# Altium schematic sheet STSPIN32F0A ESC2.SchDoc
size A3
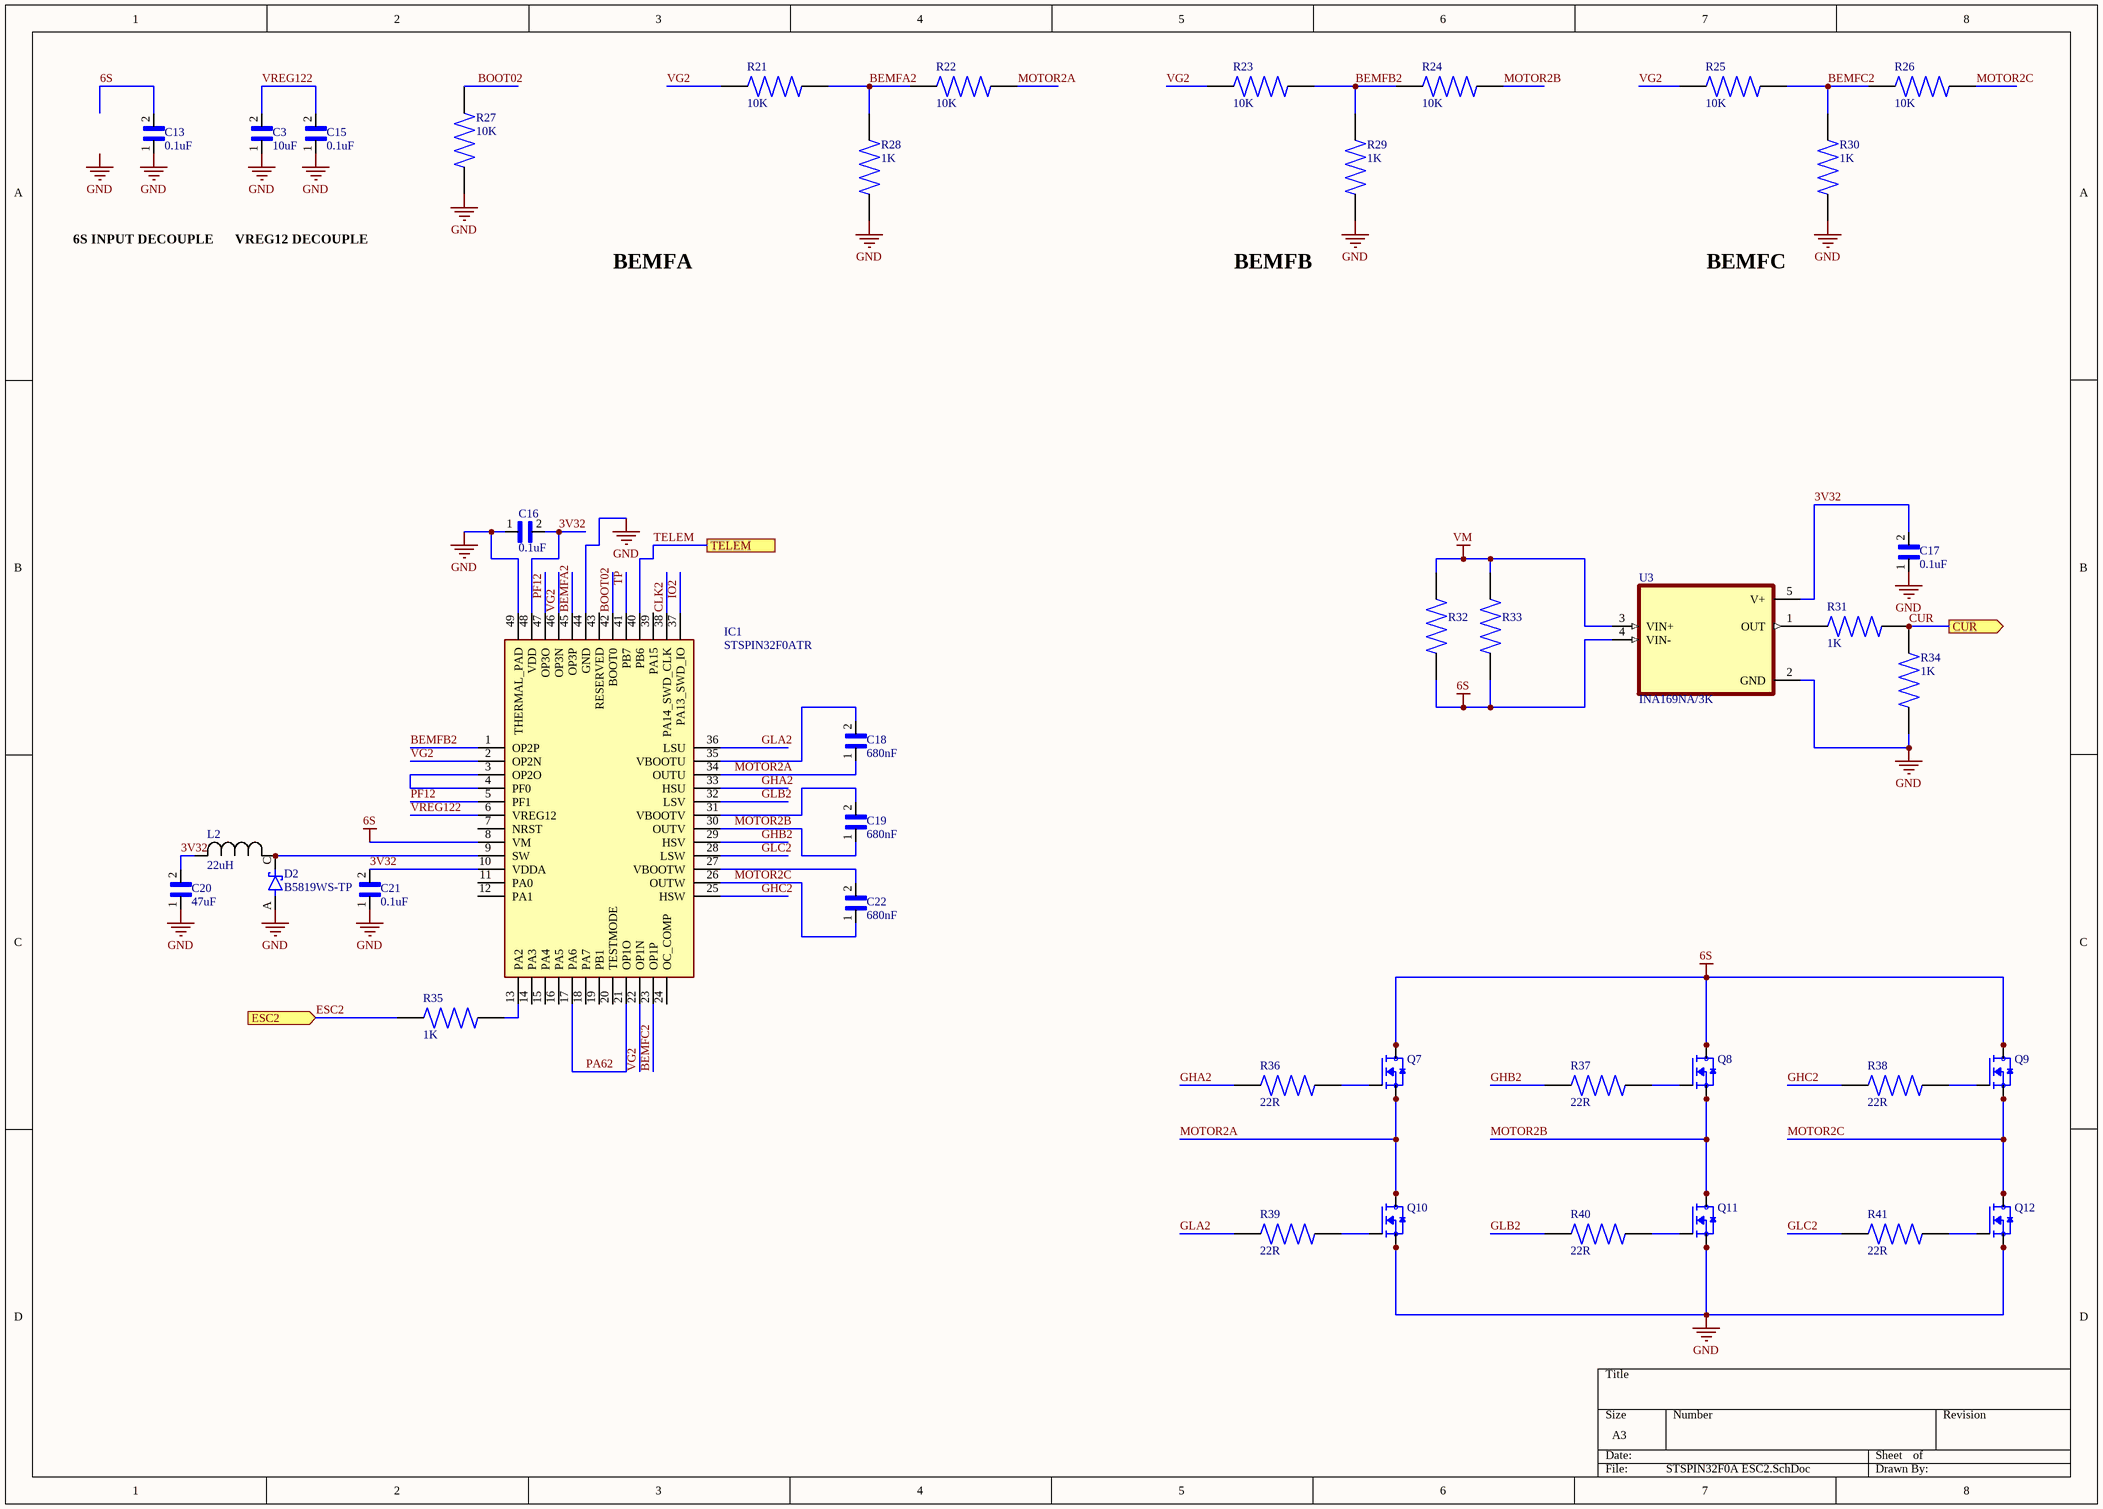
[diagram p0: STSPIN32F0A ESC2.SchDoc]

## Parts
C3  10uF  [CAPC1608X90N]
C13  0.1uF  [CAPC1005X55N]
C15  0.1uF  [CAPC1005X55N]
C16  0.1uF  [CAPC1005X55N]
C17  0.1uF  [CAPC1005X55N]
C18  680nF  [CAPC1005X55N]
C19  680nF  [CAPC1005X55N]
C20  47uF  [CAPC1608X90N]
C21  0.1uF  [CAPC1005X55N]
C22  680nF  [CAPC1005X55N]
D2  B5819WS-TP  [SOD2512X115N]
IC1  STSPIN32F0ATR  [QFN50P700X700X100-49N-D]
L2  22uH  [IND_BOURNS_SRN3015]
Q7  TPHR8504PL,L1Q  [TRANS_TPHR8504PL,L1Q]  (value not drawn)
Q8  TPHR8504PL,L1Q  [TRANS_TPHR8504PL,L1Q]  (value not drawn)
Q9  TPHR8504PL,L1Q  [TRANS_TPHR8504PL,L1Q]  (value not drawn)
Q10  TPHR8504PL,L1Q  [TRANS_TPHR8504PL,L1Q]  (value not drawn)
Q11  TPHR8504PL,L1Q  [TRANS_TPHR8504PL,L1Q]  (value not drawn)
Q12  TPHR8504PL,L1Q  [TRANS_TPHR8504PL,L1Q]  (value not drawn)
R21  10K  [RESC1005X37N]
R22  10K  [RESC1005X37N]
R23  10K  [RESC1005X37N]
R24  10K  [RESC1005X37N]
R25  10K  [RESC1005X37N]
R26  10K  [RESC1005X37N]
R27  10K  [RESC1005X37N]
R28  1K  [RESC1005X37N]
R29  1K  [RESC1005X37N]
R30  1K  [RESC1005X37N]
R31  1K  [RESC1005X37N]
R32  CSSH2512JTL500  [RESC6232X104N]  (value not drawn)
R33  CSSH2512JTL500  [RESC6232X104N]  (value not drawn)
R34  1K  [RESC1005X37N]
R35  1K  [RESC1005X37N]
R36  22R  [RESC1005X37N]
R37  22R  [RESC1005X37N]
R38  22R  [RESC1005X37N]
R39  22R  [RESC1005X37N]
R40  22R  [RESC1005X37N]
R41  22R  [RESC1005X37N]
U3  INA169NA/3K  [SOT95P280X145-5N]

## Ports
CUR (out), ESC2 (in), TELEM

## Nets
6S: C13.2 IC1.8(VM) Q7.5(D) Q7.6(D) Q7.7(D) Q7.8(D) Q7.9(D) Q8.5(D) Q8.6(D) Q8.7(D) Q8.8(D) Q8.9(D) Q9.5(D) Q9.6(D) Q9.7(D) Q9.8(D) Q9.9(D) R32.2 R33.2 U3.4(VIN-)
GND: C3.1 C13.1 C15.1 C16.1 C17.1 C20.1 C21.1 D2.A IC1.44(GND) IC1.49(THERMAL_PAD) Q10.1(S) Q10.2(S) Q10.3(S) Q11.1(S) Q11.2(S) Q11.3(S) Q12.1(S) Q12.2(S) Q12.3(S) R27.1 R28.2 R29.2 R30.2 R34.2 U3.2(GND)
VM: R32.1 R33.1 U3.3(VIN+)
3V32: C16.2 C17.2 C20.2 C21.2 IC1.10(VDDA) IC1.48(VDD) L2.2 U3.5(V+)
BEMFA2: IC1.45(OP3P) R21.1 R22.2 R28.1
BEMFB2: IC1.1(OP2P) R23.1 R24.2 R29.1
BEMFC2: IC1.23(OP1P) R25.1 R26.2 R30.1
BOOT02: IC1.42(BOOT0) R27.2
CLK2: IC1.38(PA14_SWD_CLK)
CUR: R31.2 R34.1 ; port CUR
ESC2: R35.1 ; port ESC2
GHA2: IC1.33(HSU) R36.2
GHB2: IC1.29(HSV) R37.2
GHC2: IC1.25(HSW) R38.2
GLA2: IC1.36(LSU) R39.2
GLB2: IC1.32(LSV) R40.2
GLC2: IC1.28(LSW) R41.2
IO2: IC1.37(PA13_SWD_IO)
MOTOR2A: C18.1 IC1.34(OUTU) Q7.1(S) Q7.2(S) Q7.3(S) Q10.5(D) Q10.6(D) Q10.7(D) Q10.8(D) Q10.9(D) R22.1
MOTOR2B: C19.1 IC1.30(OUTV) Q8.1(S) Q8.2(S) Q8.3(S) Q11.5(D) Q11.6(D) Q11.7(D) Q11.8(D) Q11.9(D) R24.1
MOTOR2C: C22.1 IC1.26(OUTW) Q9.1(S) Q9.2(S) Q9.3(S) Q12.5(D) Q12.6(D) Q12.7(D) Q12.8(D) Q12.9(D) R26.1
PA62: IC1.17(PA6) IC1.21(OP1O)
PF12: IC1.5(PF1) IC1.47(OP3O)
TELEM: IC1.40(PB6) ; port TELEM
TP: IC1.41(PB7)
VG2: IC1.2(OP2N) IC1.22(OP1N) IC1.46(OP3N) R21.2 R23.2 R25.2
VREG122: C3.2 C15.2 IC1.6(VREG12)
NetC18_2: C18.2 IC1.35(VBOOTU)
NetC19_2: C19.2 IC1.31(VBOOTV)
NetC22_2: C22.2 IC1.27(VBOOTW)
NetD2_C: D2.C(K) IC1.9(SW) L2.1
NetIC1_3: IC1.3(OP2O) IC1.4(PF0)
NetIC1_13: IC1.13(PA2) R35.2
NetQ7_4: Q7.4(G) R36.1
NetQ8_4: Q8.4(G) R37.1
NetQ9_4: Q9.4(G) R38.1
NetQ10_4: Q10.4(G) R39.1
NetQ11_4: Q11.4(G) R40.1
NetQ12_4: Q12.4(G) R41.1
NetR31_1: R31.1 U3.1(OUT)

Not connected (* = marked no-connect by the designer): IC1 7(NRST) 11(PA0) 12(PA1) 14(PA3) 15(PA4) 16(PA5) 18(PA7) 19(PB1) 20(TESTMODE) 24(OC_COMP) 39(PA15) 43(RESERVED)

## Notes on the sheet
- 6S INPUT DECOUPLE
- VREG12 DECOUPLE
- BEMFA
- BEMFB
- BEMFC
- Labels drawn without touching a wire or pin: GND

## Library data of the parts
C3 C20 = GRM188R71E224JA88D: SMD Capacitor X7R(EIA) with Capacitance: 0.22uF Tol. 5%. Rated Voltage: 25Vdc; Package: None; Price: None; Value: *; MP: GRM188R71E224JA88D; Availability: Unavailable
C13 C15-C19 C21 C22 = GRM1555C1H222JA01D: Package: None; Price: None; Value: *; MP: GRM1555C1H222JA01D; Availability: Unavailable
D2 = B5819WS-TP: MF: {'manufacturer': u'Micro Commercial Components'}; Package: None; MP: B5819WS-TP; Price: None; Availability: Unavailable; Value: *
IC1 = STSPIN32F0ATR: Integrated Circuit; Manufacturer_Name: STMicroelectronics; Datasheet Link: http://www.st.com/content/ccc/resource/technical/document/datasheet/group3/3d/88/0f/d1/3f/0c/49/80/DM00406030/files/DM00406030.pdf/jcr:content/translations/en.DM00406030.pdf; Height: 1mm; Manufacturer_Part_Number: STSPIN32F0ATR; Mouser Part Number: 511-STSPIN32F0ATR; Mouser Price/Stock: https://www.mouser.co.uk/ProductDetail/STMicroelectronics/STSPIN32F0ATR?qs=1mbolxNpo8flc7yUpKWOVQ%3D%3D; Arrow Part Number: STSPIN32F0ATR; Arrow Price/Stock: https://www.arrow.com/en/products/stspin32f0atr/stmicroelectronics
L2 = SRN3015-220M: No Description Available; Mfr_Name: Bourns Electronics; Type: DEV; Copyright: Copyright (C) 2022 Ultra Librarian. All rights reserved.; Manufacturer_Part_Number: SRN3015-220M; Digi-Key_Part_Number_1: SRN3015-220MCT-ND; Digi-Key_Part_Number_2: SRN3015-220MDKR-ND; Digi-Key_Part_Number_3: SRN3015-220MTR-ND; RefDes: RefDes
Q7-Q12 = TPHR8504PL,L1Q: N-Channel 40V 150A (Tc) 1W (Ta), 170W (Tc) Surface Mount 8-SOP Advance (5x5); MF: Toshiba Semiconductor; Package: SOP-8 Toshiba; Price: None; Value: *; MP: TPHR8504PL,L1Q; SnapEDA_Link: https://www.snapeda.com/parts/TPHR8504PL,L1Q/Toshiba%20Semiconductor%20and%20Storage/view-part/604439/?ref=snap; Availability: Unavailable
R21-R31 R34-R41 = RE0402BRE07330KL: MF: {'manufacturer': u'Yageo'}; Availability: Unavailable; Package: None; MP: RE0402BRE07330KL; Value: *; Price: None
R32 R33 = CSSH2512JTL500: MF: {'manufacturer': u'Stackpole Electronics Inc'}; Price: None; MP: CSSH2512JTL500; Package: None; Value: *; Availability: Unavailable
U3 = INA169NA/3K: MF: {'manufacturer': u'Texas Instruments'}; Availability: Unavailable; MP: INA169NA/3K; Value: *; Package: None; Price: None